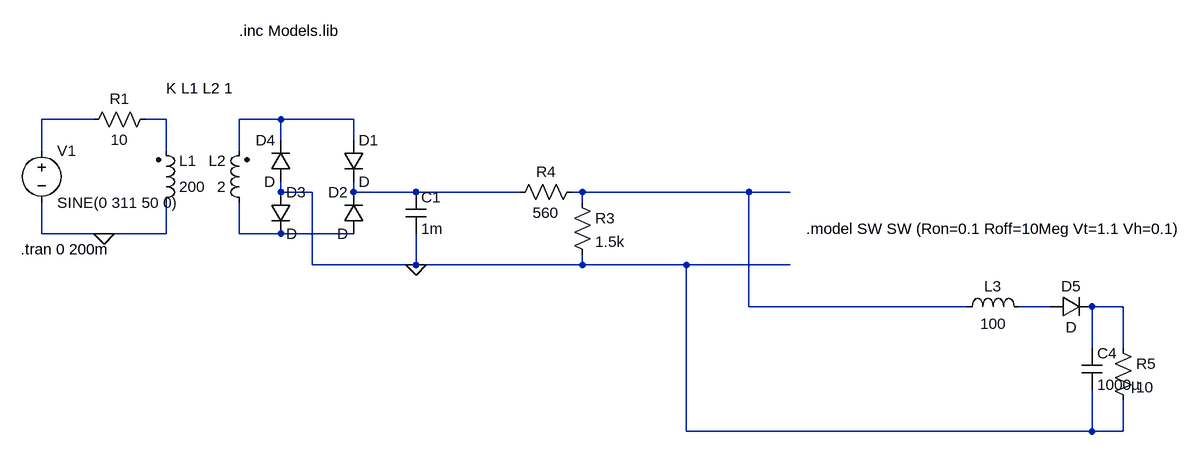
[diagram p0: schematic fuente lineal - prototipo 1.asc]
fuente lineal - prototipo 1.asc, the LTspice schematic file:
Version 4
SHEET 1 2068 852
WIRE 128 80 48 80
WIRE 240 80 208 80
WIRE 416 80 352 80
WIRE 528 80 416 80
WIRE 416 112 416 80
WIRE 528 112 528 80
WIRE 48 128 48 80
WIRE 240 128 240 80
WIRE 352 128 352 80
WIRE 416 192 416 176
WIRE 464 192 416 192
WIRE 528 192 528 176
WIRE 624 192 528 192
WIRE 784 192 624 192
WIRE 880 192 864 192
WIRE 1136 192 880 192
WIRE 1200 192 1136 192
WIRE 880 208 880 192
WIRE 48 256 48 208
WIRE 144 256 48 256
WIRE 240 256 240 208
WIRE 240 256 144 256
WIRE 352 256 352 208
WIRE 416 256 352 256
WIRE 528 256 416 256
WIRE 464 304 464 192
WIRE 624 304 624 256
WIRE 624 304 464 304
WIRE 880 304 880 288
WIRE 880 304 624 304
WIRE 1040 304 880 304
WIRE 1200 304 1040 304
WIRE 1136 368 1136 192
WIRE 1472 368 1136 368
WIRE 1600 368 1552 368
WIRE 1712 368 1664 368
WIRE 1664 432 1664 368
WIRE 1712 432 1712 368
WIRE 1040 560 1040 304
WIRE 1664 560 1664 496
WIRE 1664 560 1040 560
WIRE 1712 560 1712 512
WIRE 1712 560 1664 560
FLAG 144 256 0
FLAG 624 304 0
SYMBOL voltage 48 112 R0
WINDOW 123 0 0 Left 2
WINDOW 39 0 0 Left 2
SYMATTR InstName V1
SYMATTR Value SINE(0 311 50 0)
SYMBOL res 224 64 R90
WINDOW 0 0 56 VBottom 2
WINDOW 3 32 56 VTop 2
SYMATTR InstName R1
SYMATTR Value 10
SYMBOL ind2 224 224 M180
WINDOW 0 36 80 Left 2
WINDOW 3 36 40 Left 2
SYMATTR InstName L1
SYMATTR Value 200
SYMBOL ind2 368 224 R180
WINDOW 0 36 80 Left 2
WINDOW 3 36 40 Left 2
SYMATTR InstName L2
SYMATTR Value 2
SYMBOL diode 512 112 R0
SYMATTR InstName D1
SYMBOL diode 544 256 R180
WINDOW 0 24 64 Left 2
WINDOW 3 24 0 Left 2
SYMATTR InstName D2
SYMBOL diode 400 192 R0
SYMATTR InstName D3
SYMBOL diode 432 176 R180
WINDOW 0 24 64 Left 2
WINDOW 3 24 0 Left 2
SYMATTR InstName D4
SYMBOL cap 608 192 R0
SYMATTR InstName C1
SYMATTR Value 1m
SYMBOL res 864 192 R0
SYMATTR InstName R3
SYMATTR Value 1.5k
SYMBOL res 880 176 R90
WINDOW 0 0 56 VBottom 2
WINDOW 3 32 56 VTop 2
SYMATTR InstName R4
SYMATTR Value 560
SYMBOL ind 1456 384 R270
WINDOW 0 32 56 VTop 2
WINDOW 3 5 56 VBottom 2
SYMATTR InstName L3
SYMATTR Value 100
SYMBOL diode 1600 384 R270
WINDOW 0 32 32 VTop 2
WINDOW 3 0 32 VBottom 2
SYMATTR InstName D5
SYMBOL cap 1648 432 R0
SYMATTR InstName C4
SYMATTR Value 1000µ
SYMBOL res 1696 416 R0
SYMATTR InstName R5
SYMATTR Value 10
TEXT 240 32 Left 2 !K L1 L2 1
TEXT 16 280 Left 2 !.tran 0 200m
TEXT 352 -56 Left 2 !.inc Models.lib
TEXT 1224 248 Left 2 !.model SW SW (Ron=0.1 Roff=10Meg Vt=1.1 Vh=0.1)

The netlist it stands for:
* fuente lineal - prototipo 1.asc
V1 N001 0 SINE(0 311 50 0)
R1 N002 N001 10
L1 0 N002 200
L2 N006 N003 2
D1 N003 N004 D
D2 N006 N004 D
D3 0 N006 D
D4 0 N003 D
C1 N004 0 1m
R3 N005 0 1.5k
R4 N005 N004 560
L3 N005 N007 100
D5 N007 N008 D
C4 N008 0 1000µ
R5 N008 0 10
.model D D
.lib standard.dio
K L1 L2 1
.tran 0 200m
.inc Models.lib
.model SW SW (Ron=0.1 Roff=10Meg Vt=1.1 Vh=0.1)
.backanno
.end